# Altium schematic sheet Sht3-Regulators.SchDoc
size B; SheetNumber: 2; SheetTotal: 4
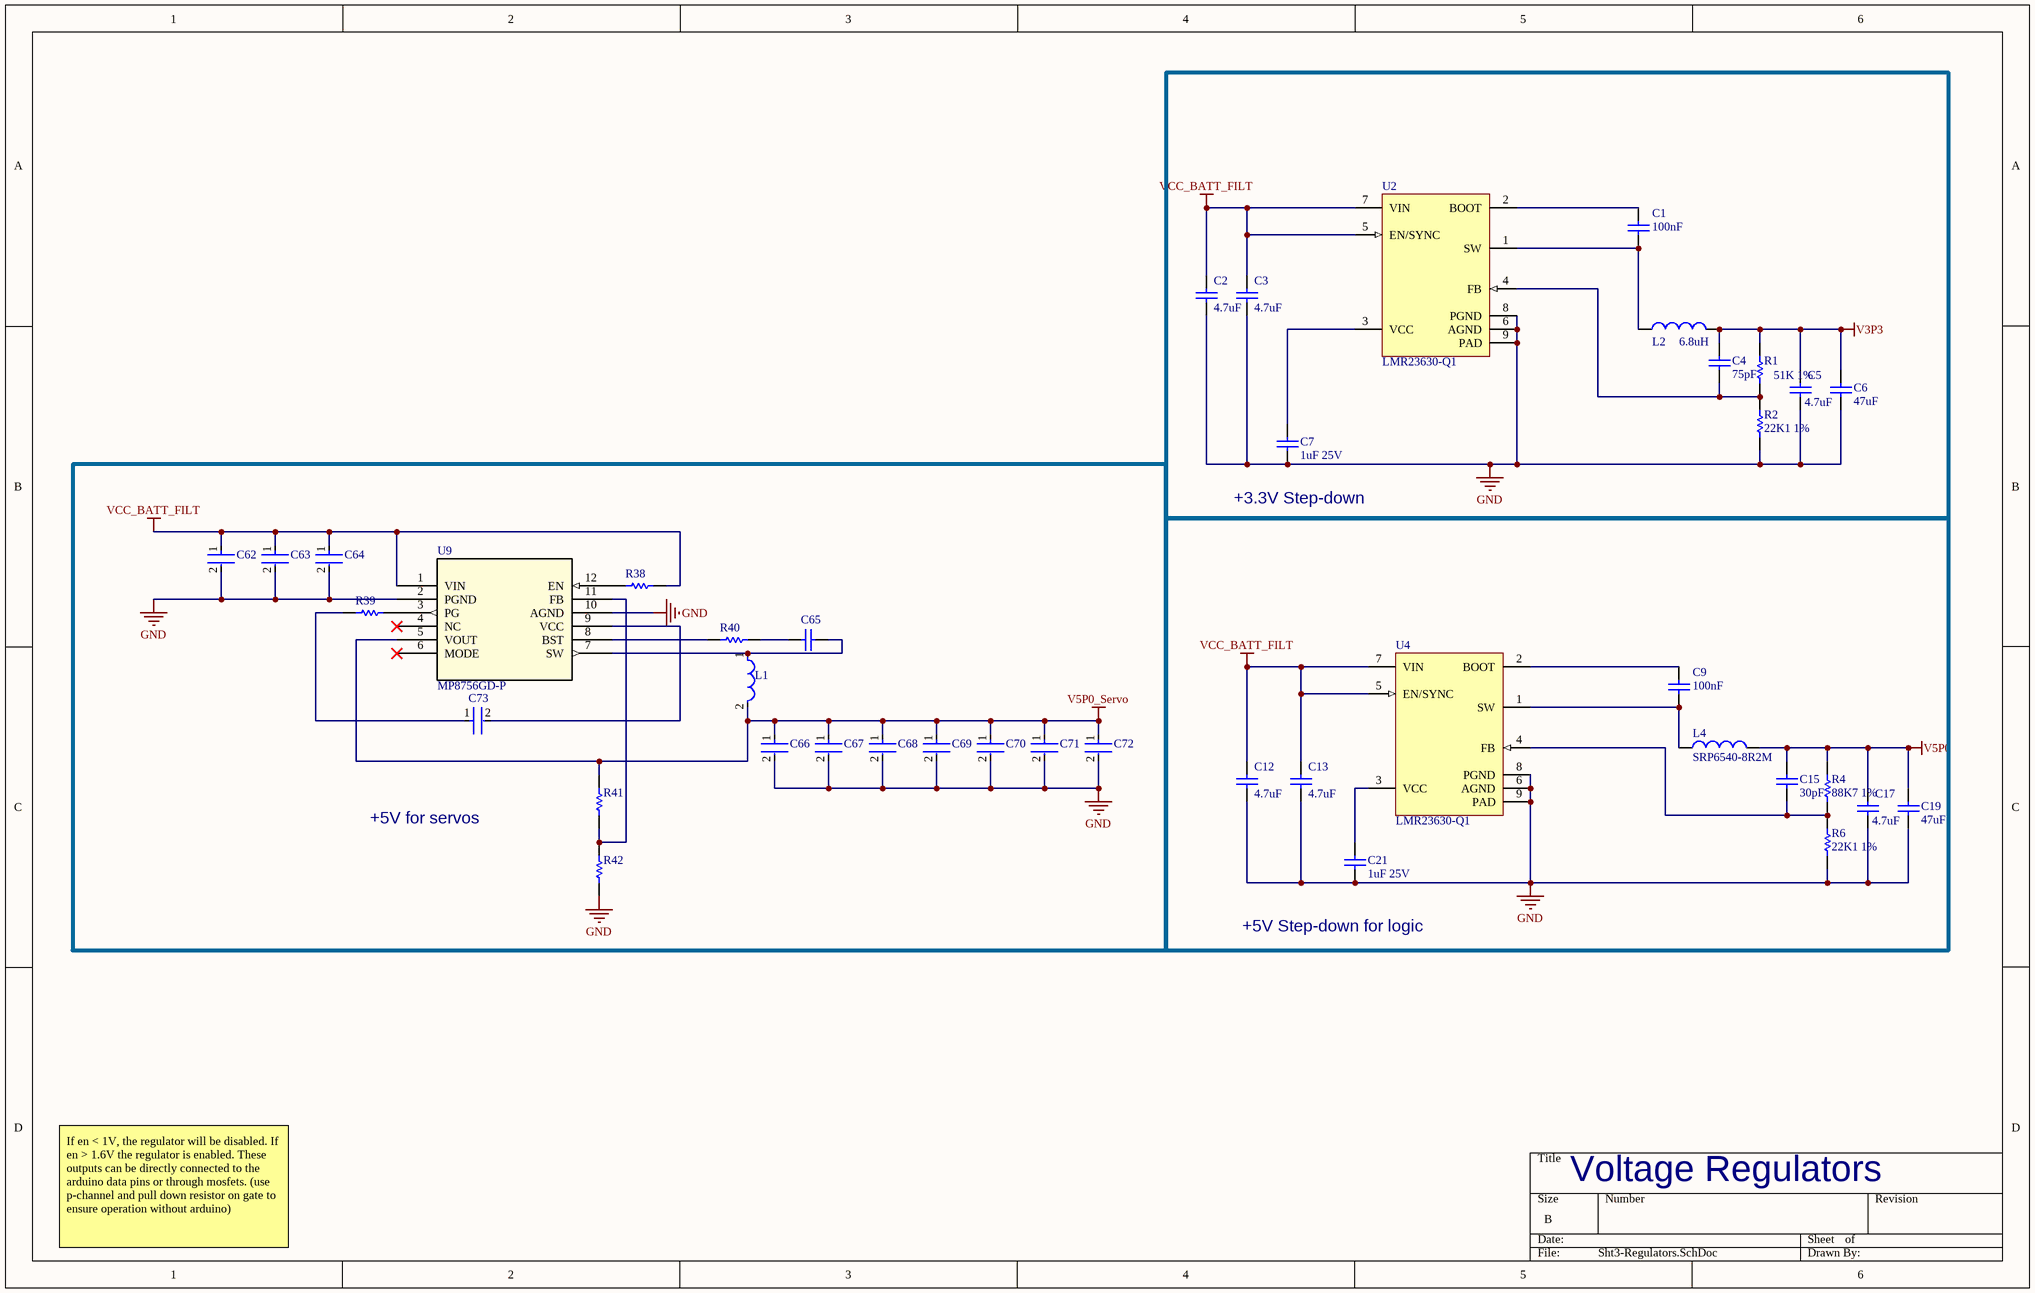
[diagram p0: Sht3-Regulators.SchDoc]

## Parts
C1  100nF  [CAPC0603(1608)100_L]
C2  4.7uF  [CAPC1206(3216)190_L]
C3  4.7uF  [CAPC1206(3216)190_L]
C4  75pF  [CAPC0603(1608)100_L]
C5  4.7uF  [CAPC1206(3216)190_L]
C6  47uF  [CAPC1206(3216)190_L]
C7  1uF 25V  [CAPC0603(1608)100_L]
C9  100nF  [CAPC0603(1608)100_L]
C12  4.7uF  [CAPC1206(3216)190_L]
C13  4.7uF  [CAPC1206(3216)190_L]
C15  30pF  [CAPC0603(1608)100_L]
C17  4.7uF  [CAPC1206(3216)190_L]
C19  47uF  [CAPC1206(3216)190_L]
C21  1uF 25V  [CAPC0603(1608)100_L]
C62  CC0603KRX7R9BB104  [FP-CC0603-DA-MFG]  (value not drawn)
C63  CL10A226MPCNUBE  [FP-CL10-IPC_B]  (value not drawn)
C64  CL10A226MPCNUBE  [FP-CL10-IPC_B]  (value not drawn)
C65  C0603C224K8NACTU  [CAPC1608X87X35NL15T15]  (value not drawn)
C66  CL10A226MPCNUBE  [FP-CL10-IPC_B]  (value not drawn)
C67  CL10A226MPCNUBE  [FP-CL10-IPC_B]  (value not drawn)
C68  CL10A226MPCNUBE  [FP-CL10-IPC_B]  (value not drawn)
C69  CL10A226MPCNUBE  [FP-CL10-IPC_B]  (value not drawn)
C70  CC0603KRX7R9BB104  [FP-CC0603-DA-MFG]  (value not drawn)
C71  CC0603KRX7R9BB104  [FP-CC0603-DA-MFG]  (value not drawn)
C72  CC0603KRX7R9BB104  [FP-CC0603-DA-MFG]  (value not drawn)
C73  CC0603KRX7R7BB105  [FP-CC0603-DA-MFG]  (value not drawn)
L1  IHLP2525CZER1R5M01  [FP-IHLP-2525CZ-FP_2_413x3-MFG]  (value not drawn)
L2  6.8uH  [BOURNS SRP5030T]
L4  SRP6540-8R2M  [BOURNS SRP5030T]
R1  51K 1%  [RESC0603(1608)_L]
R2  22K1 1%  [RESC0603(1608)_L]
R4  88K7 1%  [RESC0603(1608)_L]
R6  22K1 1%  [RESC0603(1608)_L]
R38  CRCW06031M50FKEA  [RESC1609X50X30NL10T20]  (value not drawn)
R39  ERJ-3EKF1003V  [RESC1608X55X30ML15T15]  (value not drawn)
R40  ERJ-3RQF3R3V  [RESC1608X55X30NL15T15]  (value not drawn)
R41  ERA3AEB4122V  [RESC1608X55X30LL20T20]  (value not drawn)
R42  ERJ-3EKF5601V  [RESC1609X55X30LL15T15]  (value not drawn)
U2  LMR23630-Q1  [DDA0008E_N]
U4  LMR23630-Q1  [DDA0008E_N]
U9  MP8756GD-P  [QFN-12_MP8756_MNP]

## Blocks framed on the sheet
+3.3V Step-down: C1-C7 L2 R1 R2 U2
+5V for servos: C62-C73 L1 R38-R42 U9

## Nets
GND: C2.1 C3.1 C5.1 C6.1 C7.1 C12.1 C13.1 C17.1 C19.1 C21.1 C62.2 C63.2 C64.2 C66.2 C67.2 C68.2 C69.2 C70.2 C71.2 C72.2 R2.1 R6.1 R42.2 U2.6(AGND) U2.8(PGND) U2.9(PAD) U4.6(AGND) U4.8(PGND) U4.9(PAD) U9.2(PGND) U9.10(AGND)
V3P3: C4.2 C5.2 C6.2 L2.2 R1.2
V5P0: C15.2 C17.2 C19.2 L4.2 R4.2
V5P0_Servo: C66.1 C67.1 C68.1 C69.1 C70.1 C71.1 C72.1 L1.2 R41.2 U9.5(VOUT)
VCC_BATT_FILT: C2.2 C3.2 C12.2 C13.2 C62.1 C63.1 C64.1 R38.2 U2.5(EN/SYNC) U2.7(VIN) U4.5(EN/SYNC) U4.7(VIN) U9.1(VIN)
NetC1_1: C1.1 L2.1 U2.1(SW)
NetC1_2: C1.2 U2.2(BOOT)
NetC4_1: C4.1 R1.1 R2.2 U2.4(FB)
NetC7_2: C7.2 U2.3(VCC)
NetC9_1: C9.1 L4.1 U4.1(SW)
NetC9_2: C9.2 U4.2(BOOT)
NetC15_1: C15.1 R4.1 R6.2 U4.4(FB)
NetC21_2: C21.2 U4.3(VCC)
NetC65_1: C65.1 R40.2
NetC65_2: C65.2 L1.1 U9.7(SW)
NetC73_1: C73.1 R39.1
NetC73_2: C73.2 U9.9(VCC)
NetR38_1: R38.1 U9.12(EN)
NetR39_2: R39.2 U9.3(PG)
NetR40_1: R40.1 U9.8(BST)
NetR41_1: R41.1 R42.1 U9.11(FB)

Not connected (* = marked no-connect by the designer): U9 4(NC)* 6(MODE)*

## Notes on the sheet
- (near C21) +5V Step-down for logic
- If en < 1V, the regulator will be disabled. If en > 1.6V the regulator is enabled. These outputs can be directly connected to the arduino data pins or through mosfets. (use p-channel and pull down resistor on gate to ensure operation without arduino)
- Voltage Regulators

## Library data of the parts
C1 C9 = CMP-1035-02595-1: CAP 100nF 100V ±10% 0603 (1608 Metric) Thickness 1mm SMD; Tolerance: Â±10%; Case-EIA: 0603; Case-Metric: 1608; Rated Voltage: 100 V; Value: 100nF; Technology: SMT; Max Thickness: 1 mm
C2 C3 C5 C12 C13 C17 = CMP-1037-04922-1: CAP 4.7uF 35V ±10% 1206 (3216 Metric) Thickness 1.9mm SMD; Case-EIA: 1206; Tolerance: Â±10%; Case-Metric: 3216; Rated Voltage: 35 V; Technology: SMT; Value: 4.7uF; Max Thickness: 1.9 mm
  C5 C17: Supplier 1: Digi-Key
C4 = CMP-1035-01189-1: CAP 75pF 25V ±1% 0603 (1608 Metric) Thickness 1mm SMD; Case-Metric: 1608; Case-EIA: 0603; Tolerance: Â±1%; Rated Voltage: 25 V; Technology: SMT; Max Thickness: 1 mm; Value: 75pF
C6 C19 = CMP-1037-05003-1: CAP 47uF 16V ±20% 1206 (3216 Metric) Thickness 1.9mm SMD; Case-EIA: 1206; Tolerance: Â±20%; Case-Metric: 3216; Rated Voltage: 16 V; Technology: SMT; Value: 47uF; Max Thickness: 1.9 mm
C7 C21 = CMP-1035-02740-1: CAP 1uF 25V ±10% 0603 (1608 Metric) Thickness 1mm SMD; Tolerance: Â±10%; Case-Metric: 1608; Case-EIA: 0603; Technology: SMT; Rated Voltage: 25 V; Max Thickness: 1 mm; Value: 1uF
C15 = CMP-1035-00915-1: CAP 30pF 50V ±10% 0603 (1608 Metric) Thickness 1mm SMD; Tolerance: Â±10%; Case-Metric: 1608; Case-EIA: 0603; Rated Voltage: 50 V; Technology: SMT; Value: 30pF; Max Thickness: 1 mm
C62 C70-C72 = CMP-2100-03601-2: CAP CER 0.1UF 50V X7R 0603; Manufacturer: YAGEO; Material: Ceramic; Capacitance: 100 nF; Temperature Coefficient: 15%; Tolerance: 0.1; Value: 100 nF; Height: 0.9mm; Voltage: 50 V; ComponentLink2Description: Datasheet; Device Class L2: Capacitors; Temperature Range High: +125°C; Category: Cap; Footprint Url: http://www.yageo.com/exep/pages/download/literatures/UPY-C_GEN_24.pdf; ComponentLink2URL: http://www.yageo.com/documents/recent/UPY-GPHC_X7R_6.3V-to-50V_18.pdf; Package: CC0603-DA; Temperature: -55°C to +125°C; Voltage Rating: 50 V; Temperature Characteristic: X7R; Device Class L1: Passive Components; Temperature Range Low: -55°C; Manufacturer Part Number: CC0603KRX7R9BB104; RoHS: TRUE; Automotive: No; Device Class L3: Ceramic Capacitors; Octopart: https://octopart.com/cc0603krx7r9bb104-yageo-42244635; Mouser Description: Multilayer Ceramic Capacitor, CC Series, 0.1 - F, - 10%, X7R, 50 V, 0603 [1608 Metric]; Lead Free: Yes; Digikey Description: CAP CER 0.1UF 50V X7R 0603
C63 C64 C66-C69 = CMP-13271-003290-1: Cap Ceramic 22uF 10V X5R ±20% Pad SMD 0603 +85°C T/R; Max Operating Temperature: 85°C; Packaging: Tape and Reel; Mount: Surface Mount; Width: 0.031inch; Length: 0.063inch; Min Operating Temperature: -55°C; Voltage Rating: 10V; Case/Package: 0603; Thickness: 0.037inch; Case Code (Metric): 1608; Tolerance: 20%; Case Code (Imperial): 0603; Capacitance: 22uF
C65 = CMP-2006-03148-1: 220nF 0603; Manufacturer: Kemet; Part Number: C0603C224K8NACTU
C73 = CMP-03422-000924-1: CAP CER 1UF 16V X7R 0603; Manufacturer: YAGEO; Tolerance: 0.1; Temperature Coefficient: 15%; Material: Ceramic; Package: CC0603-DA; RoHS: TRUE; Device Class L2: Capacitors; Temperature Characteristic: X7R; Temperature: -55°C to +125°C; Temperature Range Low: -55°C; Automotive: No; ComponentLink2Description: Datasheet; Value: 1 uF; Lead Free: Yes; Capacitance: 1 uF; ComponentLink2URL: http://www.yageo.com/documents/recent/UPY-GPHC_X7R_6.3V-to-50V_18.pdf; Device Class L1: Passive Components; Voltage: 16 V; Octopart: https://octopart.com/cc0603krx7r7bb105-yageo-42271928; Category: Cap; Digikey Description: CAP CER 1UF 16V X7R 0603; Footprint Url: http://www.yageo.com/exep/pages/download/literatures/UPY-C_GEN_24.pdf; Height: 0.9mm; Manufacturer Part Number: CC0603KRX7R7BB105; Voltage Rating: 16 V; Temperature Range High: +125°C; Mouser Description: Multilayer Ceramic Capacitor, CC Series, 1 - F, - 10%, X7R, 16 V, 0603 [1608 Metric]; Device Class L3: Ceramic Capacitors
L1 = CMP-2000-06441-2: Commercial Inductors, High Saturation Series 1.5uH 9A 15mΩ 20%; DC Resistance (DCR): 15mR; Shielding: Shielded; Self Resonant Frequency: 5MHz; Max DC Current: 18A; Test Frequency: 100kHz; Core Material: Metal; Packaging: Tape and Reel; RMS Current (Irms): 9A; Length: 7.24mm; Case Code (Imperial): 2525; Case/Package: 2525; Min Operating Temperature: -55°C; Number of Pins: 2; Contact Plating: Tin; Height: 3mm; Height - Seated (Max): 0.118inch; Termination: SMD/SMT; Max Operating Temperature: 125°C; Depth: 6.72mm; Width: 6.47mm; Current Rating: 9A; Tolerance: 20%; Lead Free: Lead Free; Military Standard: Not; Radiation Hardening: No; Saturation Current: 18A; Package Quantity: 2000; Inductance Tolerance: 20%; Inductance: 1.5uH; Mount: Surface Mount
L2 = SRP5030TA: Manufacturer: Bourns Inc.; Manufacturer Part Number: SRP5030TA-6R8M; Type: Wirewound; Material - Core: Carbonyl Powder; Tolerance: ±20%; Shielding: Shielded; DC Resistance (DCR): 76.2 mOhm Max; Q @ Freq: 15 @ 100kHz; Supplier 1: Digi-Key; RoHS: RoHS Compliant; Category: Inductors, Coils, Chokes; Stock 1: 5626; Pricing 1: 1=1.51, 10=1.397, 100=0.9781, 500=0.79178, 1000=0.72191 (USD); Packaging: Cut Tape (CT); Part Status: Active; Ratings: AEC-Q200; Operating Temperature: -40°C ~ 150°C; Mounting Type: Surface Mount; Package / Case: Nonstandard; Supplier Device Package: -; Size / Dimension: 0.224" L x 0.205" W (5.70mm x 5.20mm); Height - Seated (Max): 0.118" (3.00mm); ComponentLink1URL: http://www.bourns.com/docs/Product-Datasheets/SRP5030TA.pdf; ComponentLink1Description: http://www.bourns.com/docs/Product-Datasheets/SRP5030TA.pdf; Supplier Part Number 1: SRP5030TA-6R8MCT-ND
L4 = SRP5030TA_8R2: ComponentLink1URL: http://www.bourns.com/docs/Product-Datasheets/SRP5030TA.pdf; ComponentLink1Description: http://www.bourns.com/docs/Product-Datasheets/SRP5030TA.pdf; Supplier 1: Digi-Key; Supplier Part Number 1: SRP6540-8R2MCT-ND
R1 = CMP-1012-00703-1: 51K 0.1W 1% 0603 (1608 Metric)  SMD; Case-EIA: 0603; Case-Metric: 1608; Value: 51000.00 Ohm; Tolerance: 1 %; Technology: SMT; Power: 0.1 W
R2 R6 = CMP-1012-00660-1: 22K1 0.1W 1% 0603 (1608 Metric)  SMD; Case-EIA: 0603; Case-Metric: 1608; Value: 22100.00 Ohm; Tolerance: 1 %; Power: 0.1 W; Technology: SMT
R4 = CMP-1012-00730-1: 88K7 0.1W 1% 0603 (1608 Metric)  SMD; Value: 88700.00 Ohm; Case-Metric: 1608; Case-EIA: 0603; Tolerance: 1 %; Power: 0.1 W; Technology: SMT
R38 = CMP-2000-03033-1: 1M5 0603; Manufacturer: Vishay Dale; Part Number: CRCW06031M50FKEA
R39 = CMP-2000-00182-1: 100k 0603; Manufacturer: Panasonic; Part Number: ERJ-3EKF1003V
R40 = CMP-2000-00847-1: 3R3 0603; Manufacturer: Panasonic; Part Number: ERJ-3RQF3R3V
R41 = CMP-2000-00060-1: 41k2 0603; Manufacturer: Panasonic; Part Number: ERA3AEB4122V
R42 = CMP-2000-00565-2: Chip Resistor, 5.6 KOhm, +/- 1%, 0.1 W, -55 to 155 degC, 0603 (1608 Metric), RoHS, Tape and Reel; Elements: 1; Max Power Dissipation: 625 mW; hFE Min: 100; Case\Package: TO-236-3; Frequency: 300 MHz; Vce Max: 300 mV; Packaging: Tape and Reel; PackageReference: 0603; RoHSCompliant: true; ComponentLink1URL: http://www.panasonic.com/; ComponentLink2Description: Datasheet; REACH SVHC: No SVHC; PackageDescription: 2-Pin Surface Mount Device, Body 1.6 x 0.85 mm; Mount: Surface Mount; Height: 0.25 inch; Max Operating Temperature: 150 degC; Min Operating Temperature: -55 degC; ComponentLink1Description: Manufacturer URL; Width: 0.25 inch; Package Quantity: 3000; Length: 0.25 inch; DatasheetVersion: Apr-15; Pins: 3; ComponentLink2URL: http://industrial.panasonic.com/cdbs/www-data/pdf/RDA0000/AOA0000C86.pdf; Weight: 0.002116 oz; Radiation Hardening: No
U2 U4 = LMR23630-Q1: Manufacturer: Texas Instruments; Manufacturer Part Number: LMR23630AFQDDARQ1; Function: Step-Down; Output Configuration: Positive; Topology: Buck; Output Type: Adjustable; Number of Outputs: 1; Voltage - Input (Min): 4.5V; Voltage - Input (Max): 36V; Voltage - Output (Min/Fixed): 1V; Voltage - Output (Max): 28V; Current - Output: 3A; Frequency - Switching: 400kHz; Synchronous Rectifier: Yes; Supplier 1: Digi-Key; RoHS: RoHS Compliant; Category: Integrated Circuits (ICs); Stock 1: 1636; Pricing 1: 1=3.97, 10=3.564, 100=2.9204, 500=2.48604, 1000=2.09667 (USD); Packaging: Digi-Reel®; Part Status: Active; Operating Temperature: -40°C ~ 125°C (TJ); Mounting Type: Surface Mount; Package / Case: 8-SOIC (0.154", 3.90mm Width) Exposed Pad; Supplier Device Package: 8-SO PowerPad; ComponentLink1URL: http://www.ti.com/lit/ds/symlink/lmr23630-q1.pdf; ComponentLink1Description: http://www.ti.com/lit/ds/symlink/lmr23630-q1.pdf; Supplier Part Number 1: 296-45260-6-ND
U9 = MP8756GD-P: No Description Available; Mfr_Name: Monolithic Power Systems; RefDes: RefDes; Type: Type